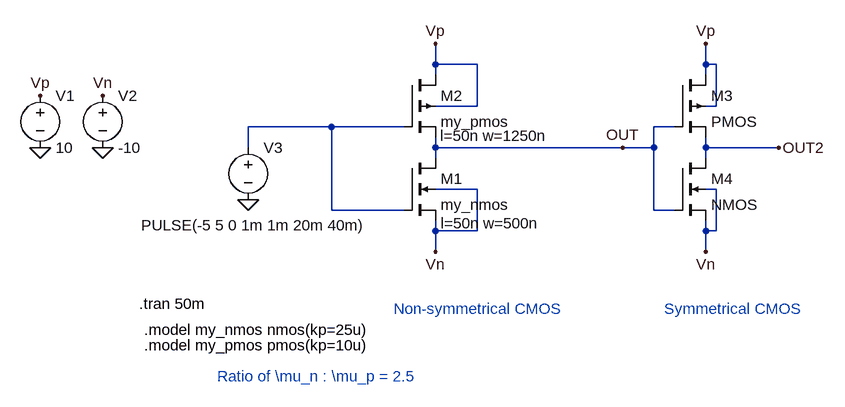
[diagram p0: schematic Week6_CMOS_Inverter.asc]
Week6_CMOS_Inverter.asc, the LTspice schematic file:
Version 4
SHEET 1 960 680
WIRE 352 32 352 0
WIRE 416 32 352 32
WIRE 768 32 768 0
WIRE 784 32 768 32
WIRE 352 48 352 32
WIRE 768 48 768 32
WIRE 416 96 416 32
WIRE 416 96 352 96
WIRE 784 96 784 32
WIRE 784 96 768 96
WIRE 192 128 64 128
WIRE 304 128 192 128
WIRE 720 128 688 128
WIRE 64 160 64 128
WIRE 352 160 352 144
WIRE 640 160 352 160
WIRE 688 160 688 128
WIRE 688 160 640 160
WIRE 768 160 768 144
WIRE 880 160 768 160
WIRE 352 176 352 160
WIRE 768 176 768 160
WIRE 416 224 352 224
WIRE 784 224 768 224
WIRE 192 256 192 128
WIRE 304 256 192 256
WIRE 688 256 688 160
WIRE 720 256 688 256
WIRE 352 288 352 272
WIRE 416 288 416 224
WIRE 416 288 352 288
WIRE 768 288 768 272
WIRE 784 288 784 224
WIRE 784 288 768 288
WIRE 352 320 352 288
WIRE 768 320 768 288
FLAG -256 160 0
FLAG -160 160 0
FLAG 64 240 0
FLAG -256 80 Vp
FLAG -160 80 Vn
FLAG 352 320 Vn
FLAG 352 0 Vp
FLAG 640 160 OUT
FLAG 768 320 Vn
FLAG 768 0 Vp
FLAG 880 160 OUT2
SYMBOL nmos4 304 176 R0
WINDOW 123 56 100 Left 2
SYMATTR InstName M1
SYMATTR Value my_nmos
SYMATTR Value2 l=50n w=500n
SYMBOL pmos4 304 48 R0
WINDOW 123 55 94 Left 2
SYMATTR InstName M2
SYMATTR Value my_pmos
SYMATTR Value2 l=50n w=1250n
SYMBOL voltage -256 64 R0
WINDOW 123 0 0 Left 0
WINDOW 39 0 0 Left 0
SYMATTR InstName V1
SYMATTR Value 10
SYMBOL voltage -160 64 R0
WINDOW 123 0 0 Left 0
WINDOW 39 0 0 Left 0
SYMATTR InstName V2
SYMATTR Value -10
SYMBOL voltage 64 144 R0
WINDOW 3 -165 135 Left 2
WINDOW 123 0 0 Left 0
WINDOW 39 0 0 Left 0
SYMATTR Value PULSE(-5 5 0 1m 1m 20m 40m)
SYMATTR InstName V3
SYMBOL pmos4 720 48 R0
SYMATTR InstName M3
SYMBOL nmos4 720 176 R0
SYMATTR InstName M4
TEXT -104 400 Left 2 !.tran 50m
TEXT 704 408 Left 2 ;Symmetrical CMOS
TEXT 288 408 Left 2 ;Non-symmetrical CMOS
TEXT -96 440 Left 2 !.model my_nmos nmos(kp=25u)
TEXT -96 464 Left 2 !.model my_pmos pmos(kp=10u)
TEXT 16 512 Left 2 ;Ratio of \\mu_n : \\mu_p = 2.5

The netlist it stands for:
* Week6_CMOS_Inverter.asc
M1 OUT N001 Vn Vn my_nmos l=50n w=500n
M2 Vp N001 OUT Vp my_pmos l=50n w=1250n
V1 Vp 0 10
V2 Vn 0 -10
V3 N001 0 PULSE(-5 5 0 1m 1m 20m 40m)
M3 Vp OUT OUT2 Vp PMOS
M4 OUT2 OUT Vn Vn NMOS
.model NMOS NMOS
.model PMOS PMOS
.lib standard.mos
.tran 50m
* Symmetrical CMOS
* Non-symmetrical CMOS
.model my_nmos nmos(kp=25u)
.model my_pmos pmos(kp=10u)
* Ratio of \mu_n : \mu_p = 2.5
.backanno
.end